# EAGLE schematic wdc (EAGLE 7.7.0)
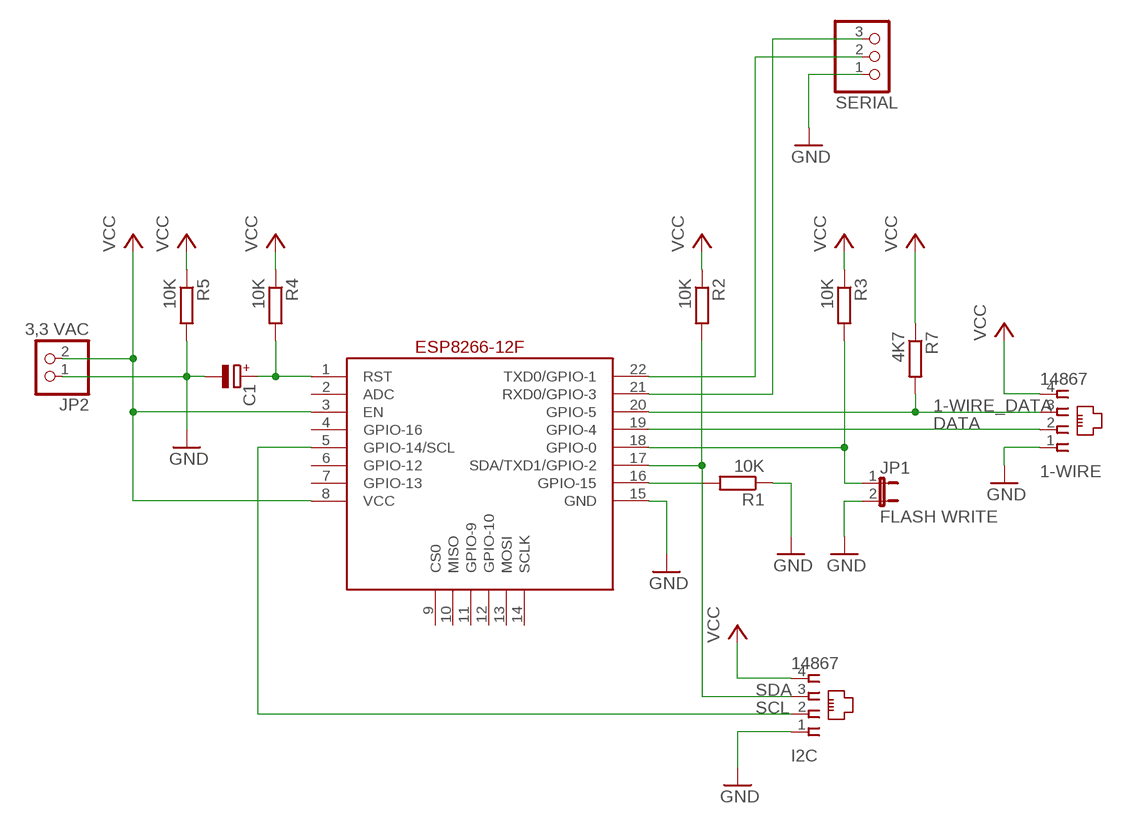
[diagram p0: schematic, sheet 1]

## Parts
1-WIRE  14867  [14867]
C1  CPOL-EUE2-5  [E2-5]
I2C  14867  [14867]
JP1  FLASH WRITE  JP1E  [JP1]
JP2  3,3 VAC  PINHD-1X2  [1X02]
R1  10K  R-EU_0204/7  [0204/7]
R2  10K  R-EU_0204/7  [0204/7]
R3  10K  R-EU_0204/7  [0204/7]
R4  10K  R-EU_0204/7  [0204/7]
R5  10K  R-EU_0204/7  [0204/7]
R7  4K7  R-EU_0204/7  [0204/7]
SERIAL  PINHD-1X3  [1X03]
U$1  ESP826612F  [ESP826612F]

## Nets
1-WIRE_DATA: 1-WIRE.3 R7.2 U$1.20(GPIO-5)
DATA: 1-WIRE.2 U$1.19(GPIO-4)
GND: 1-WIRE.1 C1.- I2C.1 JP1.2 JP2.1 R1.1 R5.2 SERIAL.1 U$1.15(GND)
N$1: R1.2 U$1.16(GPIO-15)
N$3: JP1.1 R3.2 U$1.18(GPIO-0)
N$4: C1.+ R4.2 U$1.1(RST)
N$5: SERIAL.2 U$1.22(TXD0/GPIO-1)
N$6: SERIAL.3 U$1.21(RXD0/GPIO-3)
SCL: I2C.2 U$1.5(GPIO-14/SCL)
SDA: I2C.3 R2.2 U$1.17(SDA/TXD1/GPIO-2)
VCC: 1-WIRE.4 I2C.4 JP2.2 R2.1 R3.1 R4.1 R5.1 R7.1 U$1.3(EN) U$1.8(VCC)
Unconnected: U$1.2(ADC) U$1.4(GPIO-16) U$1.6(GPIO-12) U$1.7(GPIO-13) U$1.9(CS0) U$1.10(MISO) U$1.11(GPIO-9) U$1.12(GPIO-10) U$1.13(MOSI) U$1.14(SCLK)

## Library data of the parts
1-WIRE I2C = con-4ucon:14867: RJ11 Connector Source: 4UCON TECHNOLOGY INC. 14867.pdf; OC_FARNELL: unknown; OC_NEWARK: unknown
C1 = rcl:CPOL-EU: POLARIZED CAPACITOR, European symbol
JP1 = jumper:JP1E: JUMPER
JP2 = pinhead:PINHD-1X2: PIN HEADER
R1-R5 R7 = resistor:R-EU_: RESISTOR, European symbol
SERIAL = pinhead:PINHD-1X3: PIN HEADER
U$1 = ESP8266:ESP826612F